# EAGLE design Layout_Controller_Peter (EAGLE 5.07)
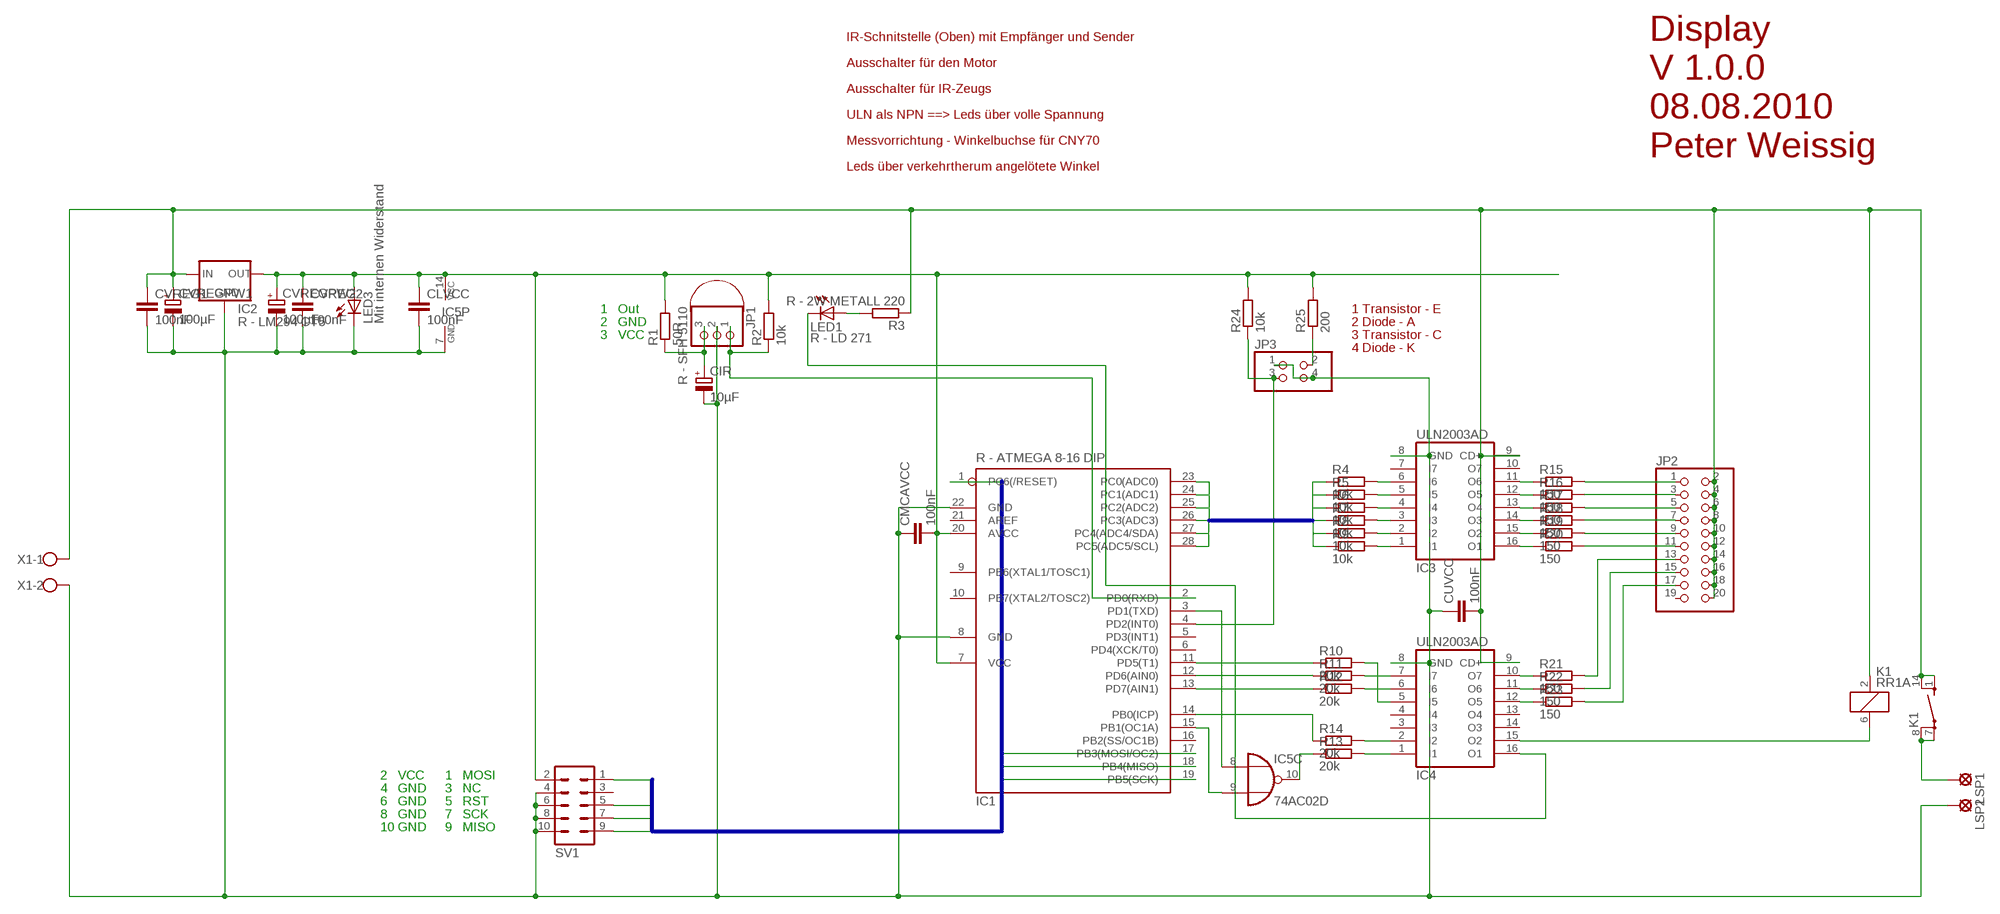
[diagram p0: schematic, sheet 1]

## Parts
CIR  10µF  CPOL-EUE2.5-6  [E2,5-6]
CLVCC  100nF  C-EU025-030X050  [C025-030X050]
CMCAVCC  100nF  C-EU025-030X050  [C025-030X050]
CUVCC  100nF  C-EU025-030X050  [C025-030X050]
CVREG1  100nF  C-EU025-030X050  [C025-030X050]
CVREG2  100nF  C-EU025-030X050  [C025-030X050]
CVREGPW1  100µF  CPOL-EUE5-10.5  [E5-10,5]
CVREGPW2  100µF  CPOL-EUE5-10.5  [E5-10,5]
IC1  R - ATMEGA 8-16 DIP  MEGA8-P  [DIL28-3]
IC2  R - LM294 CT5  78XXS  [78XXS]
IC3  ULN2003AD  [SO16]
IC4  ULN2003AD  [SO16]
IC5  74AC02D  [SO14]
JP1  R - SFH 5110  PINHD-1X3  [1X03]
JP2  PINHD-2X10/90  [2X10/90]
JP3  PINHD-2X2/90  [2X02/90]
K1  RR1A  [RR1A]
LED1  R - LD 271  LED5MM  [LED5MM]
LED3  Mit internen Widerstand  LED3MM  [LED3MM]
LSP1  SE14  [SE14]
LSP2  SE14  [SE14]
R1  50R  R-EU_0207/10  [0207/10]
R2  10k  R-EU_0207/10  [0207/10]
R3  R - 2W METALL 220  R-EU_0207/10  [0207/10]
R4  10k  R-EU_0207/10  [0207/10]
R5  10k  R-EU_0207/10  [0207/10]
R6  10k  R-EU_0207/10  [0207/10]
R7  10k  R-EU_0207/10  [0207/10]
R8  10k  R-EU_0207/10  [0207/10]
R9  10k  R-EU_0207/10  [0207/10]
R10  20k  R-EU_M1206  [M1206]
R11  20k  R-EU_M1206  [M1206]
R12  20k  R-EU_M1206  [M1206]
R13  20k  R-EU_M1206  [M1206]
R14  20k  R-EU_M1206  [M1206]
R15  150  R-EU_M1206  [M1206]
R16  150  R-EU_M1206  [M1206]
R17  150  R-EU_M1206  [M1206]
R18  150  R-EU_M1206  [M1206]
R19  150  R-EU_M1206  [M1206]
R20  150  R-EU_M1206  [M1206]
R21  150  R-EU_M1206  [M1206]
R22  150  R-EU_M1206  [M1206]
R23  150  R-EU_M1206  [M1206]
R24  10k  R-EU_0207/2V  [0207/2V]
R25  200  R-EU_M1206  [M1206]
SV1  ML10  [ML10]
X1  W237-102  [W237-102]

## Nets
BUS_LED0: IC1.23(PC0(ADC0)) R4.1
BUS_LED1: IC1.24(PC1(ADC1)) R5.1
BUS_LED2: IC1.25(PC2(ADC2)) R6.1
BUS_LED3: IC1.26(PC3(ADC3)) R7.1
BUS_LED4: IC1.27(PC4(ADC4/SDA)) R8.1
BUS_LED5: IC1.28(PC5(ADC5/SCL)) R9.1
GND: CIR.- CLVCC.2 CMCAVCC.1 CUVCC.1 CVREG1.2 CVREG2.2 CVREGPW1.- CVREGPW2.- IC1.8(GND) IC1.22(GND) IC2.GND IC3.8(GND) IC4.8(GND) IC5.7(P:GND) JP1.2 JP3.1 JP3.4 LED3.K(C) LSP2.MP SV1.4 SV1.6 SV1.8 SV1.10 X1.2
ISP0: IC1.17(PB3(MOSI/OC2)) SV1.1
ISP1: IC1.1(PC6(/RESET)) SV1.5
ISP2: IC1.19(PB5(SCK)) SV1.7
ISP3: IC1.18(PB4(MISO)) SV1.9
N$1: CIR.+ JP1.3 R1.1
N$2: IC3.3(I3) R7.2
N$3: IC3.2(I2) R8.2
N$4: IC3.1(I1) R9.2
N$5: IC3.11(O6) R15.1
N$6: IC3.4(I4) R6.2
N$7: IC3.5(I5) R5.2
N$8: IC3.6(I6) R4.2
N$9: IC4.7(I7) R11.2
N$10: IC4.6(I6) R12.2
N$11: IC1.14(PB0(ICP)) R14.1
N$12: IC4.15(O2) K1.6
N$13: IC4.5(I5) R10.2
N$14: IC4.1(I1) R13.2
N$15: IC4.2(I2) R14.2
N$16: JP2.1 R15.2
N$17: JP2.3 R16.2
N$18: JP2.5 R17.2
N$19: JP2.7 R18.2
N$20: IC1.13(PD7(AIN1)) R12.1
N$21: IC1.12(PD6(AIN0)) R11.1
N$22: K1.7(2:P) K1.8(2:P) LSP1.MP
N$23: IC1.11(PD5(T1)) R10.1
N$24: IC5.10(C:O) R13.1
N$25: IC1.15(PB1(OC1A)) IC5.9(C:I1)
N$26: LED1.A R3.2
N$27: IC4.16(O1) LED1.K(C)
N$28: JP2.9 R19.2
N$29: JP2.11 R20.2
N$30: IC4.10(O7) R21.1
N$31: IC4.11(O6) R22.1
N$32: IC4.12(O5) R23.1
N$33: IC3.12(O5) R16.1
N$34: IC3.13(O4) R17.1
N$35: IC3.14(O3) R18.1
N$36: IC3.15(O2) R19.1
N$37: IC3.16(O1) R20.1
N$45: JP2.13 R21.2
N$46: JP2.15 R22.2
N$47: JP2.17 R23.2
N$49: IC1.4(PD2(INT0)) JP3.3 R24.1
N$51: JP3.2 R25.1
RXTX0: IC1.2(PD0(RXD)) JP1.1 R2.1
RXTX1: IC1.3(PD1(TXD)) IC5.8(C:I0)
VCC_5V: CLVCC.1 CMCAVCC.2 CVREG2.1 CVREGPW2.+ IC1.7(VCC) IC1.20(AVCC) IC2.OUT IC5.14(P:VCC) LED3.A R1.2 R2.2 R24.2 R25.2 SV1.2
VCC_9V: CUVCC.2 CVREG1.1 CVREGPW1.+ IC2.IN IC3.9(CD+) IC4.9(CD+) JP2.2 JP2.4 JP2.6 JP2.8 JP2.10 JP2.12 JP2.14 JP2.16 JP2.18 JP2.20 K1.1(2:S) K1.2 K1.14(2:S) R3.1 X1.1
Unconnected: IC1.5(PD3(INT1)) IC1.6(PD4(XCK/T0)) IC1.9(PB6(XTAL1/TOSC1)) IC1.10(PB7(XTAL2/TOSC2)) IC1.16(PB2(SS/OC1B)) IC1.21(AREF) IC3.7(I7) IC3.10(O7) IC4.3(I3) IC4.4(I4) IC4.13(O4) IC4.14(O3) IC5.1(A:O) IC5.2(A:I0) IC5.3(A:I1) IC5.4(B:O) IC5.5(B:I0) IC5.6(B:I1) IC5.11(D:I0) IC5.12(D:I1) IC5.13(D:O) JP2.19 SV1.3

## Buses
ISP[0..3]
BUS_LED[0..5]

## Notes on the sheet
- IR-Schnitstelle (Oben) mit Empfänger und Sender | Display
- Ausschalter für den Motor
- V 1.0.0
- Ausschalter für IR-Zeugs
- ULN als NPN ==> Leds über volle Spannung | 08.08.2010
- Messvorrichtung - Winkelbuchse für CNY70
- Peter Weissig
- Leds über verkehrtherum angelötete Winkel
- 1   Out | 1 Transistor - E
- 2   GND | 2 Diode - A
- 3   VCC | 3 Transistor - C
- 4 Diode - K
- 2   VCC | 1   MOSI
- 4   GND | 3   NC
- 6   GND | 5   RST
- 8   GND | 7   SCK
- 10 GND | 9   MISO

## Library data of the parts
CIR CVREGPW1 CVREGPW2 = rcl:CPOL-EU: POLARIZED CAPACITOR, European symbol
CLVCC CMCAVCC CUVCC CVREG1 CVREG2 = rcl:C-EU: CAPACITOR, European symbol
IC1 = atmel:MEGA8-P: MICROCONTROLLER 8 Kbytes FLASH, 1 kbytes SRAM, 512 bytes EEPROM, USART, 4-channel 10 bit ADC, 2-channel 8 bit ADC Pin compatible with Atmega48, ATMega88, ATMega168 Source: avr.lbr
IC2 = v-reg:78XXS: VOLTAGE REGULATOR
IC3 IC4 = uln-udn:ULN2003A: DRIVER ARRAY
IC5 = 74xx-eu:74*02: Quad 2-input NOR gate
JP1 = pinhead:PINHD-1X3: PIN HEADER
JP2 = pinhead:PINHD-2X10: PIN HEADER
JP3 = pinhead:PINHD-2X2: PIN HEADER
K1 = relay:RR1A: RELAY reed, polarity, 1 x norm. open with shield
LED1 LED3 = led:LED: LED OSRAM: - CHIPLED LG R971, LG N971, LY N971, LG Q971, LY Q971, LO R971, LY R971 LH N974, LH R974 LS Q976, LO Q976, LY Q976 LO Q996 - Hyper CHIPLED LW Q18S LB Q993, LB Q99A, LB R99A - SideLED LS A670, LO A670, LY A670, LG A670, LP A670 LB A673, LV A673, LT A673, LW A673 LH A674 LY A675 LS A676, LA A676, LO A676, LY A676, LW A676 LS A679, LY A679, LG A679 - Hyper Micro SIDELED® LS Y876, LA Y876, LO Y876, LY Y876 LT Y87S - SmartLED LW L88C, LW L88S LB L89C, LB L89S, LG L890 LS L89K, LO L89K, LY L89K LS L896, LA L896, LO L896, LY L896 - TOPLED LS T670, LO T670, LY T670, LG T670, LP T670 LSG T670, LSP T670, LSY T670, LOP T670, LYG T670 LG T671, LOG T671, LSG T671 LB T673, LV T673, LT T673, LW T673 LH T674 LS T676, LA T676, LO T676, LY T676, LB T676, LH T676, LSB T676, LW T676 LB T67C, LV T67C, LT T67C, LS T67K, LO T67K, LY T67K, LW E67C LS E67B, LA E67B, LO E67B, LY E67B, LB E67C, LV E67C, LT E67C LW T67C LS T679, LY T679, LG T679 LS T770, LO T770, LY T770, LG T770, LP T770 LB T773, LV T773, LT T773, LW T773 LH T774 LS E675, LA E675, LY E675, LS T675 LS T776, LA T776, LO T776, LY T776, LB T776 LHGB T686 LT T68C, LB T68C - Hyper Mini TOPLED® LB M676 - Mini TOPLED Santana® LG M470 LS M47K, LO M47K, LY M47K Source: http://www.osram.convergy.de LUXEON: - LUMILED® LXK2-PW12-R00, LXK2-PW12-S00, LXK2-PW14-U00, LXK2-PW14-V00 LXK2-PM12-R00, LXK2-PM12-S00, LXK2-PM14-U00 LXK2-PE12-Q00, LXK2-PE12-R00, LXK2-PE12-S00, LXK2-PE14-T00, LXK2-PE14-U00 LXK2-PB12-K00, LXK2-PB12-L00, LXK2-PB12-M00, LXK2-PB14-N00, LXK2-PB14-P00, LXK2-PB14-Q00 LXK2-PR12-L00, LXK2-PR12-M00, LXK2-PR14-Q00, LXK2-PR14-R00 LXK2-PD12-Q00, LXK2-PD12-R00, LXK2-PD12-S00 LXK2-PH12-R00, LXK2-PH12-S00 LXK2-PL12-P00, LXK2-PL12-Q00, LXK2-PL12-R00 Source: www.luxeon.com KINGBRIGHT: KA-3528ASYC Source: www.kingbright.com
LSP1 LSP2 = solpad:SE14: SOLDER PAD E1553, drill 1,4mm, distributor Buerklin, 07F820
R1-R25 = rcl:R-EU_: RESISTOR, European symbol
SV1 = con-harting-ml:ML10: HARTING
X1 = con-wago-500:W237-102: WAGO SCREW CLAMP

## Board
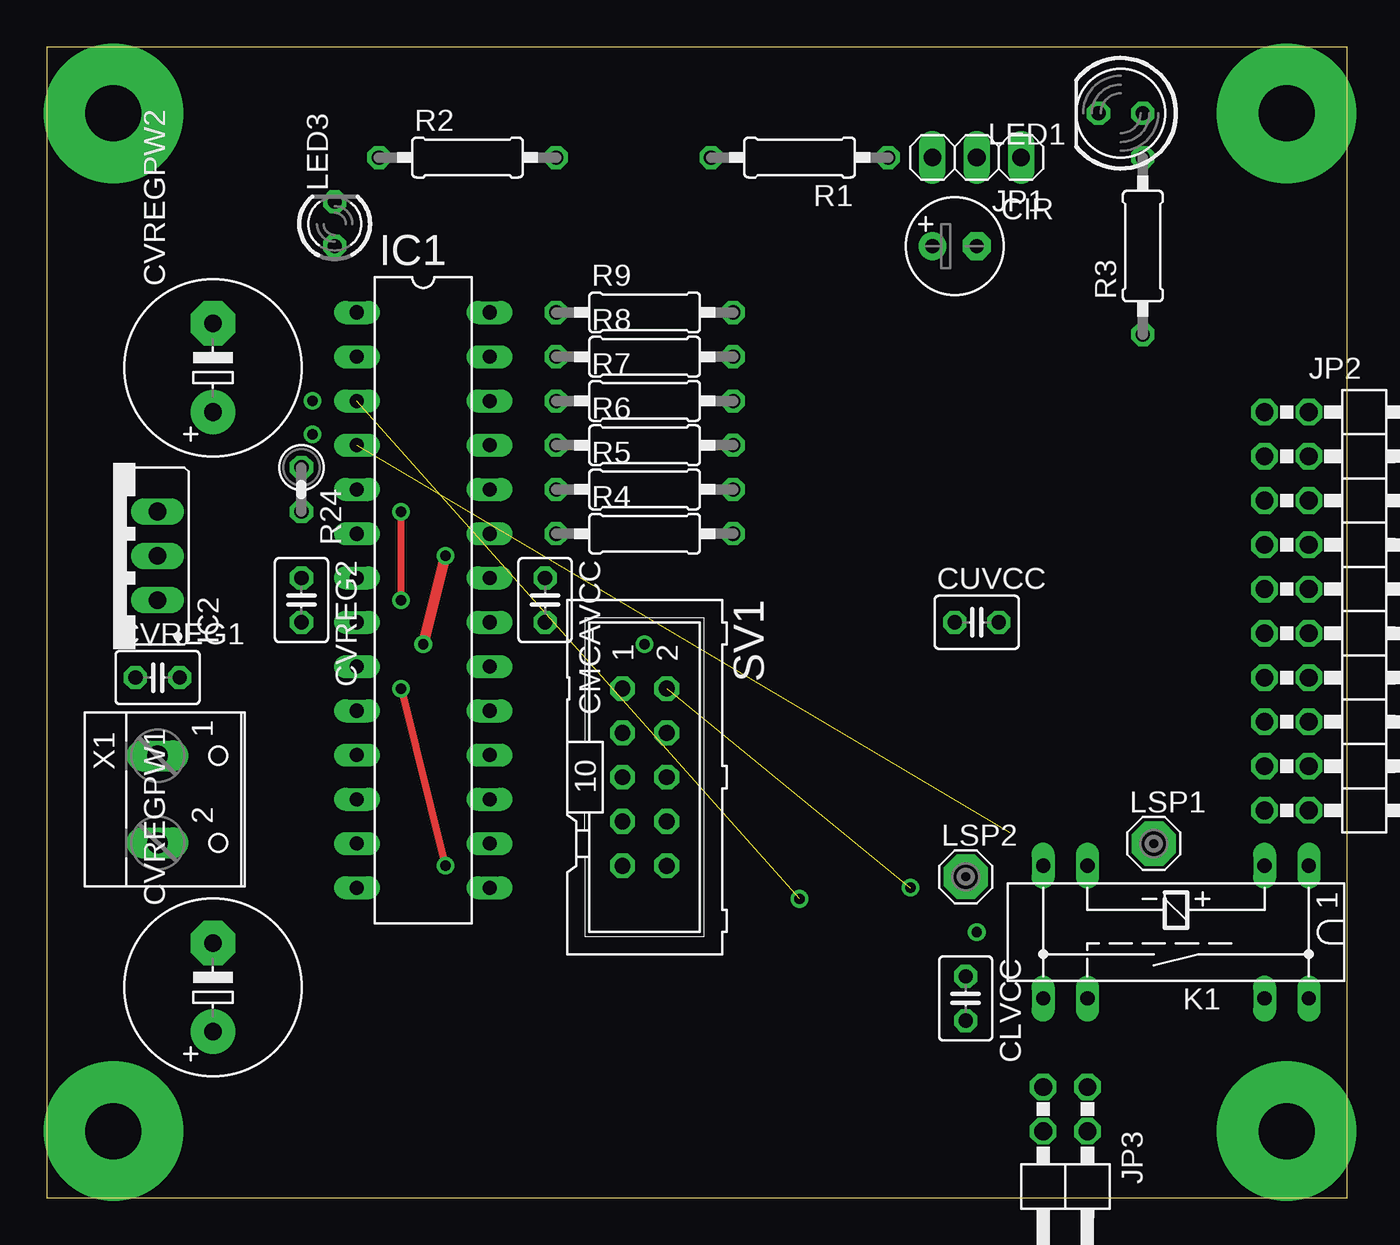
[diagram p1: board, top side]
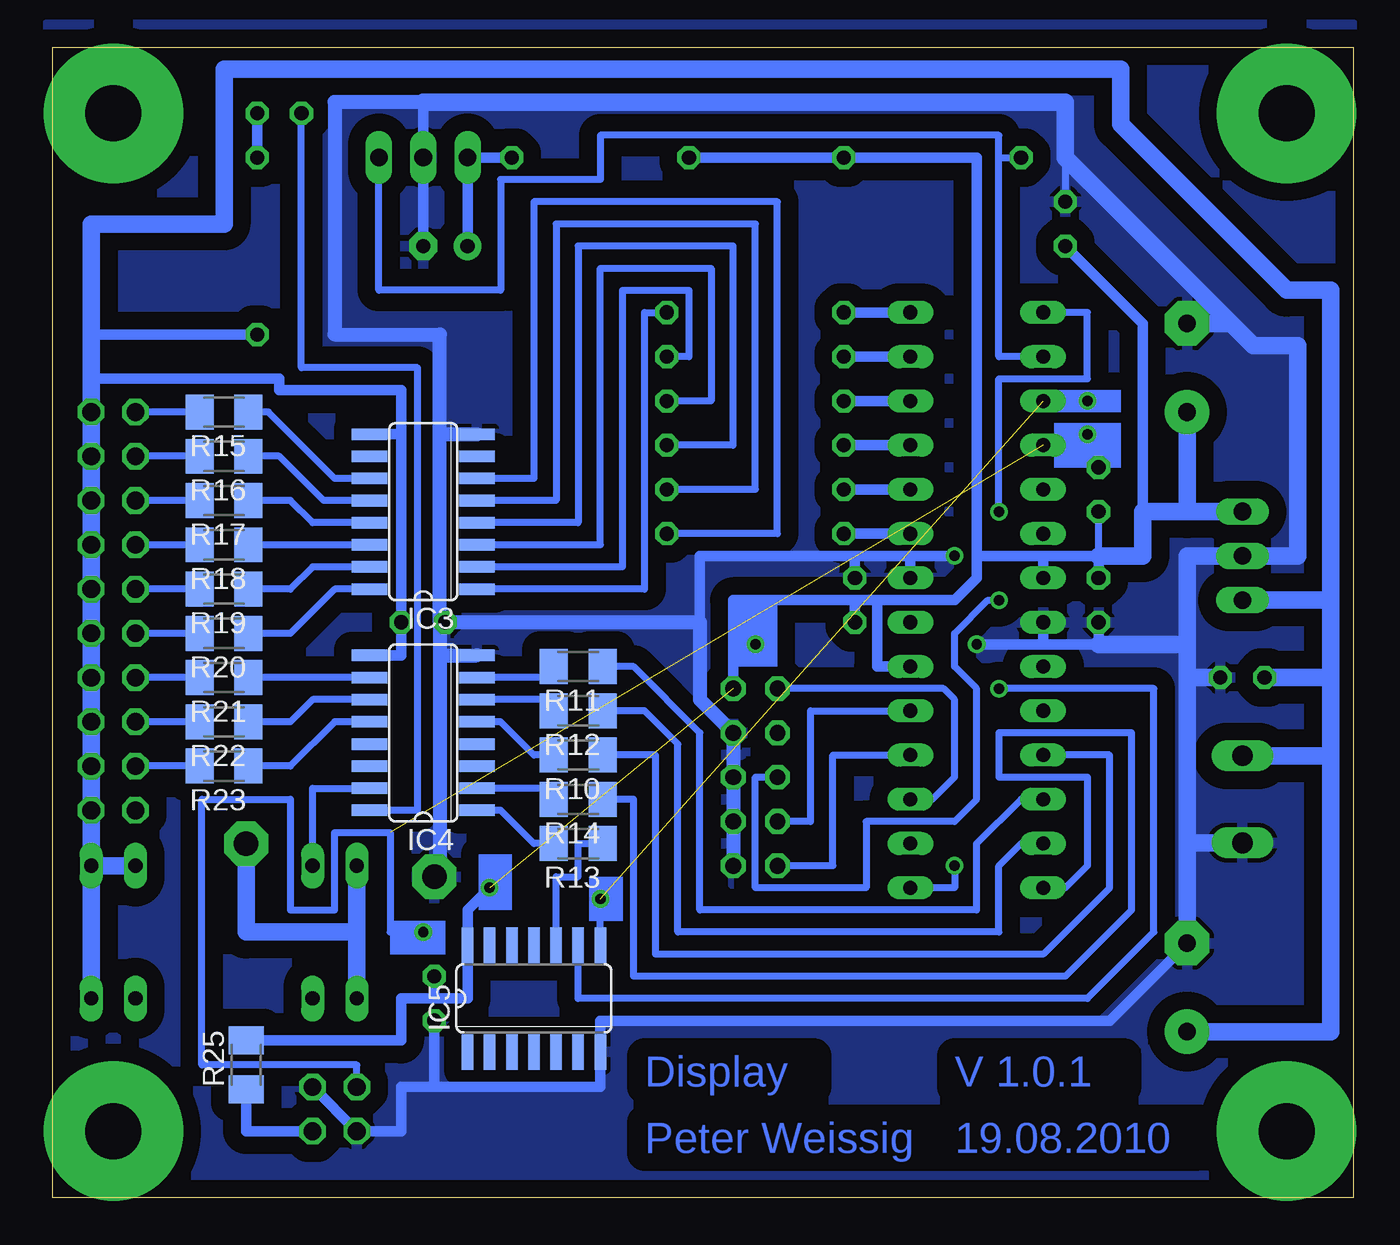
[diagram p2: board, bottom side, seen from below]

Size 74.6 x 66.03 mm. Coordinates in mm from the lower left corner, seen from the top.
Outline: 0,0 74.6,0 74.6,66.03 0,66.03 0,0
Copper layers (1*16): Top 0.035mm / dielectric 1.5mm / Bottom 0.035mm
Design rules "default": minimum track width 10mil, minimum drill 24mil, track to track 8mil, track to pad 8mil, pad to pad 8mil, via to via 8mil, smd to smd 8mil, copper to edge 40mil, drill to drill 8mil, minimum pad ring 10mil, minimum via ring 8mil, stop-mask expansion 4mil, vias tented up to drill 0mil, thermal gap 10mil
tRestrict: 1 lines
vRestrict: 2 lines

### Footprints (pad centres in the part's own frame; a part is rotated, then mirrored left to right if it is on the bottom)
E2,5-6 = drill 0.813 pad 1.6 round: + -1.27,0 | drill 0.813 pad 1.6 octagon: - 1.27,0
C025-030X050 = drill 0.813 octagon: 1 -1.27,0; 2 1.27,0
E5-10,5 = drill 1.016 pad 2.54 round: + -2.54,0 | drill 1.016 pad 2.54 octagon: - 2.54,0
DIL28-3 = drill 0.813 long: 1 -16.51,-3.81; 2 -13.97,-3.81; 3 -11.43,-3.81; 4 -8.89,-3.81; 5 -6.35,-3.81; 6 -3.81,-3.81; 7 -1.27,-3.81; 8 1.27,-3.81; 9 3.81,-3.81; 10 6.35,-3.81; 11 8.89,-3.81; 12 11.43,-3.81; 13 13.97,-3.81; 14 16.51,-3.81; 15 16.51,3.81; 16 13.97,3.81; 17 11.43,3.81; 18 8.89,3.81; 19 6.35,3.81; 20 3.81,3.81; 21 1.27,3.81; 22 -1.27,3.81; 23 -3.81,3.81; 24 -6.35,3.81; 25 -8.89,3.81; 26 -11.43,3.81; 27 -13.97,3.81; 28 -16.51,3.81
78XXS = drill 1.016 long: GND 0,-2.54; IN -2.54,-2.54; OUT 2.54,-2.54
SO16 = smd 0.66 x 2.032: 1 -4.445,-3.073; 2 -3.175,-3.073; 3 -1.905,-3.073; 4 -0.635,-3.073; 5 0.635,-3.073; 6 1.905,-3.073; 7 3.175,-3.073; 8 4.445,-3.073; 9 4.445,3.073; 10 3.175,3.073; 11 1.905,3.073; 12 0.635,3.073; 13 -0.635,3.073; 14 -1.905,3.073; 15 -3.175,3.073; 16 -4.445,3.073
SO14 = smd 0.66 x 2.032: 1 -3.81,-3.073; 2 -2.54,-3.073; 3 -1.27,-3.073; 4 0,-3.073; 5 1.27,-3.073; 6 2.54,-3.073; 7 3.81,-3.073; 8 3.81,3.073; 9 2.54,3.073; 10 1.27,3.073; 11 0,3.073; 12 -1.27,3.073; 13 -2.54,3.073; 14 -3.81,3.073
1X03 = drill 1.016 long: 1 -2.54,0; 2 0,0; 3 2.54,0
2X10/90 = drill 1.016 octagon: 1 -11.43,-6.35; 2 -11.43,-3.81; 3 -8.89,-6.35; 4 -8.89,-3.81; 5 -6.35,-6.35; 6 -6.35,-3.81; 7 -3.81,-6.35; 8 -3.81,-3.81; 9 -1.27,-6.35; 10 -1.27,-3.81; 11 1.27,-6.35; 12 1.27,-3.81; 13 3.81,-6.35; 14 3.81,-3.81; 15 6.35,-6.35; 16 6.35,-3.81; 17 8.89,-6.35; 18 8.89,-3.81; 19 11.43,-6.35; 20 11.43,-3.81
2X02/90 = drill 1.016 octagon: 1 -1.27,-6.35; 2 -1.27,-3.81; 3 1.27,-6.35; 4 1.27,-3.81
RR1A = drill 0.813 long: 1 -7.62,-3.81; 2 -5.08,-3.81; 6 5.08,-3.81; 7 7.62,-3.81; 8 7.62,3.81; 9 5.08,3.81; 13 -5.08,3.81; 14 -7.62,3.81
LED5MM = drill 0.813 octagon: A -1.27,0; K 1.27,0
LED3MM = drill 0.813 octagon: A -1.27,0; K 1.27,0
SE14 = drill 1.397 pad 2.54 octagon: MP 0,0
0207/10 = drill 0.813 octagon: 1 -5.08,0; 2 5.08,0
M1206 = smd 1.6 x 2: 1 -1.4,0; 2 1.4,0
0207/2V = drill 0.813 octagon: 1 -1.27,0; 2 1.27,0
ML10 = drill 0.914 octagon: 1 -5.08,-1.27; 2 -5.08,1.27; 3 -2.54,-1.27; 4 -2.54,1.27; 5 0,-1.27; 6 0,1.27; 7 2.54,-1.27; 8 2.54,1.27; 9 5.08,-1.27; 10 5.08,1.27
W237-102 = drill 1.194 long: 1 -2.5,-1.27; 2 2.5,-1.27

### Placement (x,y rotation side)
CIR  52.07,54.61 0 top
CLVCC  52.7,11.43 270 top
CMCAVCC  28.57,34.29 270 top
CUVCC  53.34,33.02 0 top
CVREG1  6.35,29.84 0 top
CVREG2  14.61,34.29 270 top
CVREGPW1  9.53,12.06 90 top
CVREGPW2  9.53,47.62 90 top
IC1  21.59,34.29 270 top
IC2  3.81,36.83 90 top
IC3  53.34,39.37 90 bottom
IC4  53.34,26.67 90 bottom
IC5  46.99,11.43 0 bottom
JP1  53.34,59.69 180 top
JP2  76.2,33.66 270 top
JP3  58.42,0 180 top
K1  64.77,15.24 180 top
LED1  61.59,62.23 180 top
LED3  16.51,55.88 90 top
LSP1  63.5,20.32 0 top
LSP2  52.7,18.41 0 top
R1  43.18,59.69 180 top
R2  24.13,59.69 0 top
R3  62.87,54.61 90 top
R4  34.29,38.1 0 top
R5  34.29,40.64 0 top
R6  34.29,43.18 0 top
R7  34.29,45.72 0 top
R8  34.29,48.26 0 top
R9  34.29,50.8 0 top
R10  44.45,25.4 180 bottom
R11  44.45,30.48 180 bottom
R12  44.45,27.94 180 bottom
R13  44.45,20.32 180 bottom
R14  44.45,22.86 180 bottom
R15  64.77,45.09 180 bottom
R16  64.77,42.55 180 bottom
R17  64.77,40.01 180 bottom
R18  64.77,37.47 180 bottom
R19  64.77,34.92 180 bottom
R20  64.77,32.38 180 bottom
R21  64.77,29.84 180 bottom
R22  64.77,27.3 180 bottom
R23  64.77,24.77 180 bottom
R24  14.61,40.64 270 top
R25  63.5,7.62 90 bottom
SV1  34.29,24.13 270 top
X1  7.62,22.86 270 top

### Tracks (layer width: path | path; a pad name or v marks a point on that pad's centre or on a via)
BUS_LED0
  Bottom 0.61: IC1.23 R4.1
BUS_LED1
  Bottom 0.61: IC1.24 R5.1
BUS_LED2
  Bottom 0.61: IC1.25 R6.1
BUS_LED3
  Bottom 0.61: IC1.26 R7.1
BUS_LED4
  Bottom 0.61: IC1.27 R8.1
BUS_LED5
  Bottom 0.61: IC1.28 R9.1
GND  (via drill 0.6)
  Top 0.61: v21.59,31.75 v22.86,36.83
  Bottom 0.406: CUVCC.1 52.39,33.02 | 16.51,59.69 LED3.K
  Bottom 0.61: 53.34,62.87 JP1.2 CIR.- | 25.4,36.83 IC1.22 | v22.86,36.83 25.4,36.83 | 37.47,33.02 37.47,36.83 28.57,36.83 | 28.57,36.83 CMCAVCC.1 | 25.4,36.83 28.57,36.83 | 17.78,31.75 v21.59,31.75 | 17.78,31.75 IC1.8 | 17.78,31.75 14.61,31.75 CVREG2.2 | JP3.1 JP3.4 54.61,3.81 54.61,6.35 52.7,6.35 | 52.7,6.35 43.18,6.35 IC5.7 43.18,10.16 13.97,10.16 CVREGPW1.- | 52.7,6.35 CLVCC.2
  Bottom 0.813: 52.39,31.11 IC4.8 | 52.39,43.81 52.39,33.02 52.39,31.11 | 52.39,43.81 IC3.8 | 53.34,62.87 58.42,62.87 58.42,49.53 52.39,49.53 52.39,43.81 | SV1.10 SV1.8 SV1.6 SV1.4 37.47,28.57 37.47,33.02 CUVCC.1 | LSP2.MP 52.39,18.41 52.39,31.11
  Bottom 1.016: 9.53,31.75 14.61,31.75 | 9.53,20.36 9.53,29.84 | 9.53,29.84 9.53,31.75 | 9.53,20.36 X1.2 | CVREGPW1.- 9.53,20.36 | 9.53,31.75 9.53,36.83 IC2.GND 3.17,36.83 3.17,48.9 5.71,48.9 6.99,50.16 | 9.53,29.84 CVREG1.2 | 6.99,50.16 CVREGPW2.- | 53.34,62.87 16.51,62.87 16.51,59.69 6.99,50.16
  pour Bottom (isolate 1.016): 0,67.31 74.93,67.31 74.93,0 0,0
ISP0
  Bottom 0.406: SV1.1 23.5,29.21 22.86,28.57 22.86,24.13 24.13,22.86 IC1.17
ISP1  (via drill 0.6)
  Top 0.406: v20.32,34.29 v20.32,39.37
  Bottom 0.406: SV1.5 34.29,24.13 34.29,17.78 27.94,17.78 27.94,21.59 22.86,21.59 21.59,22.86 21.59,29.21 22.86,30.48 22.86,32.38 20.95,34.29 v20.32,34.29 | IC1.1 15.24,50.8 15.24,46.99 20.32,46.99 v20.32,39.37
ISP2
  Bottom 0.406: IC1.19 31.11,27.94 31.11,21.59 SV1.7
ISP3
  Bottom 0.406: IC1.18 29.84,25.4 29.84,19.05 SV1.9
N$1
  Bottom 0.61: CIR.+ JP1.3 R1.1
N$2
  Bottom 0.406: R7.2 36.83,45.72 36.83,53.34 43.18,53.34 43.18,37.47 IC3.3
N$3
  Bottom 0.406: R8.2 38.1,48.26 38.1,52.07 41.91,52.07 41.91,36.2 IC3.2
N$4
  Bottom 0.406: R9.2 40.64,50.8 40.64,34.92 IC3.1
N$5
  Bottom 0.406: IC3.11 58.42,41.27 62.23,45.09 R15.1
N$6
  Bottom 0.406: R6.2 35.56,43.18 35.56,54.61 44.45,54.61 44.45,38.73 IC3.4
N$7
  Bottom 0.406: R5.2 34.29,40.64 34.29,55.88 45.72,55.88 45.72,40.01 IC3.5
N$8
  Bottom 0.406: R4.2 33.02,38.1 33.02,57.15 46.99,57.15 46.99,41.27 IC3.6
N$9
  Bottom 0.406: IC4.7 45.85,29.84 R11.2
N$10
  Bottom 0.406: IC4.6 45.85,28.57 R12.2
N$11
  Bottom 0.406: 43.18,22.86 R14.1 41.27,22.86 41.27,12.7 16.51,12.7 12.7,16.51 12.7,26.67 20.32,26.67 20.32,24.13 15.24,24.13 15.24,19.05 16.51,17.78 IC1.14
N$12
  Bottom 0.406: IC4.15 59.69,23.5 K1.6
N$13
  Bottom 0.406: IC4.5 48.9,27.3 46.99,25.4 R10.2
N$14
  Bottom 0.406: IC4.1 48.9,22.23 46.99,20.32 R13.2
N$15
  Bottom 0.406: IC4.2 45.85,23.5 R14.2
N$16
  Bottom 0.406: R15.2 JP2.1
N$17
  Bottom 0.406: R16.2 JP2.3
N$18
  Bottom 0.406: R17.2 JP2.5
N$19
  Bottom 0.406: R18.2 JP2.7
N$20
  Bottom 0.406: R12.1 40.64,27.94 38.73,26.04 38.73,15.24 20.32,15.24 20.32,19.05 19.05,20.32 IC1.13
N$21
  Bottom 0.406: R11.1 41.27,30.48 37.47,26.67 37.47,16.51 21.59,16.51 21.59,20.32 19.05,22.86 IC1.12
N$22
  Bottom 1.016: K1.8 57.15,15.24 | 57.15,15.24 K1.7 | LSP1.MP 63.5,15.24 57.15,15.24
N$23
  Bottom 0.406: R10.1 40.01,25.4 40.01,13.97 17.78,13.97 13.97,17.78 13.97,25.4 IC1.11
N$24
  Bottom 0.406: R13.1 44.45,20.32 44.45,18.41 45.72,18.41 IC5.10
N$25  (via drill 0.6)
  Top 0.406: v20.32,29.21 v22.86,19.05
  Bottom 0.406: IC1.15 22.86,17.78 v22.86,19.05 | v20.32,29.21 11.43,29.21 11.43,15.24 15.24,11.43 44.45,11.43 IC5.9
N$26
  Bottom 0.61: R3.2 LED1.A
N$27
  Bottom 0.406: IC4.16 53.66,22.23 53.66,47.62 60.33,47.62 LED1.K
N$28
  Bottom 0.406: R19.2 JP2.9
N$29
  Bottom 0.406: R20.2 JP2.11
N$30
  Bottom 0.406: IC4.10 R21.1
N$31
  Bottom 0.406: IC4.11 59.69,28.57 60.96,27.3 R22.1
N$32
  Bottom 0.406: IC4.12 58.42,27.3 60.96,24.77 R23.1
N$33
  Bottom 0.406: IC3.12 59.05,40.01 61.59,42.55 R16.1
N$34
  Bottom 0.406: IC3.13 59.69,38.73 60.96,40.01 R17.1
N$35
  Bottom 0.406: IC3.14 R18.1
N$36
  Bottom 0.406: IC3.15 59.69,36.2 60.96,34.92 R19.1
N$37
  Bottom 0.406: IC3.16 58.42,34.92 60.96,32.38 R20.1
N$38  (via drill 0.6)
  other vias: 34.29,31.75
N$45
  Bottom 0.406: R21.2 JP2.13
N$46
  Bottom 0.406: R22.2 JP2.15
N$47
  Bottom 0.406: R23.2 JP2.17
N$48  (via drill 3.2 pad 8)
  other vias: 3.81,62.23
N$49  (via drill 0.6)  (1 unrouted)
  Bottom 0.406: JP3.3 57.15,7.62 66.04,7.62 66.04,22.86 60.96,22.86 60.96,16.51 58.42,16.51 58.42,20.95 55.24,20.95 55.24,15.24 v53.34,15.24 | 15.24,43.18 IC1.4 | 15.24,43.18 v15.24,43.81 | R24.1 14.61,43.18 15.24,43.18
N$51
  Bottom 0.61: JP3.2 63.5,3.81 R25.1
N$52  (via drill 3.2 pad 8)
  other vias: 3.81,3.81
N$53  (via drill 3.2 pad 8)
  other vias: 71.12,3.81
N$54  (via drill 3.2 pad 8)
  other vias: 71.12,62.23
RXTX0
  Bottom 0.406: JP1.1 55.88,52.07 48.9,52.07 48.9,58.42 43.18,58.42 43.18,60.96 20.32,60.96 20.32,59.69 | 20.32,59.69 20.32,48.26 IC1.2 | 20.32,59.69 R2.1
RXTX1  (via drill 0.6)  (1 unrouted)
  Bottom 0.406: IC5.8 v43.18,17.14 | v15.24,45.72 IC1.3
VCC_5V  (via drill 0.6)  (1 unrouted)
  Bottom 0.406: 14.61,36.83 R24.2
  Bottom 0.61: R1.2 R2.2 21.59,59.69 21.59,36.83 | 28.57,34.29 CMCAVCC.2 | 27.3,34.29 22.86,34.29 21.59,35.56 21.59,36.83 | 27.3,34.29 28.57,34.29 | SV1.2 35.56,34.29 28.57,34.29 | 17.78,36.83 14.61,36.83 CVREG2.1 | 17.78,36.83 21.59,36.83 | 17.78,36.83 IC1.7 | R25.2 54.61,9.02 54.61,11.43 52.7,11.43 | 52.7,11.43 50.8,11.43 IC5.14 50.8,16.51 v49.53,17.78 | IC1.20 27.3,30.48 27.3,34.29 | 52.7,11.43 CLVCC.1 | 12.06,38.73 12.06,50.16 LED3.A
  Bottom 1.016: 14.61,36.83 12.06,36.83 12.06,38.73 12.06,39.37 9.53,39.37 | IC2.OUT 9.53,39.37 | 9.53,39.37 CVREGPW2.+
VCC_9V
  Bottom 0.406: 72.39,46.99 72.39,47.62
  Bottom 0.61: IC4.9 54.61,31.11 CUVCC.2 54.61,43.81 | 54.61,43.81 IC3.9 | 54.61,43.81 54.61,46.35 61.59,46.35 61.59,46.99 72.39,46.99 | 72.39,49.53 R3.1
  Bottom 1.016: K1.1 K1.2 | K1.1 JP2.20 JP2.18 JP2.16 JP2.14 JP2.12 JP2.10 JP2.8 JP2.6 JP2.4 JP2.2 72.39,46.99 72.39,49.53 72.39,55.88 64.77,55.88 64.77,64.77 13.34,64.77 13.34,61.59 3.81,52.07 1.27,52.07 1.27,34.29 | K1.1 K1.14 | CVREGPW1.+ 1.27,9.53 1.27,25.36 | 1.27,25.36 X1.1 | 1.27,25.36 1.27,29.84 | 1.27,29.84 1.27,34.29 | 1.27,34.29 IC2.IN | 1.27,29.84 CVREG1.1
(copper drawn outside any net)
  shapes: Bottom area x6

### Text on the board
Bottom: V 1.0.1 | Display | 19.08.2010 | Peter Weissig